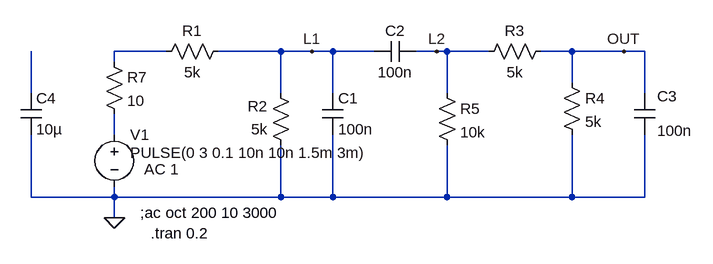
[diagram p0: schematic CW-PHONE-BAND-PASS-LTSpice.asc]
CW-PHONE-BAND-PASS-LTSpice.asc, the LTspice schematic file:
Version 4
SHEET 1 1256 680
WIRE 96 80 16 80
WIRE 272 80 176 80
WIRE 320 80 272 80
WIRE 352 80 320 80
WIRE 416 80 352 80
WIRE 512 80 480 80
WIRE 528 80 512 80
WIRE 592 80 528 80
WIRE 720 80 672 80
WIRE 800 80 720 80
WIRE 832 80 800 80
WIRE 16 96 16 80
WIRE 720 128 720 80
WIRE -112 144 -112 80
WIRE 272 144 272 80
WIRE 352 144 352 80
WIRE 528 144 528 80
WIRE 832 144 832 80
WIRE 16 208 16 176
WIRE -112 304 -112 208
WIRE 16 304 16 288
WIRE 16 304 -112 304
WIRE 272 304 272 224
WIRE 272 304 16 304
WIRE 352 304 352 208
WIRE 352 304 272 304
WIRE 528 304 528 224
WIRE 528 304 352 304
WIRE 720 304 720 208
WIRE 720 304 528 304
WIRE 832 304 832 208
WIRE 832 304 720 304
WIRE 16 336 16 304
FLAG 16 336 0
FLAG 800 80 OUT
FLAG 320 80 L1
FLAG 512 80 L2
SYMBOL voltage 16 192 R0
WINDOW 123 46 69 Left 2
WINDOW 39 0 0 Left 0
WINDOW 3 24 44 Left 2
SYMATTR Value2 AC 1
SYMATTR InstName V1
SYMATTR Value PULSE(0 3 0.1 10n 10n 1.5m 3m)
SYMBOL res 192 64 R90
WINDOW 0 0 56 VBottom 2
WINDOW 3 32 56 VTop 2
SYMATTR InstName R1
SYMATTR Value 5k
SYMBOL res 288 240 R180
WINDOW 0 36 76 Left 2
WINDOW 3 36 40 Left 2
SYMATTR InstName R2
SYMATTR Value 5k
SYMBOL res 576 96 R270
WINDOW 0 32 56 VTop 2
WINDOW 3 0 56 VBottom 2
SYMATTR InstName R3
SYMATTR Value 5k
SYMBOL res 704 112 R0
SYMATTR InstName R4
SYMATTR Value 5k
SYMBOL cap 336 144 R0
SYMATTR InstName C1
SYMATTR Value 100n
SYMBOL cap 480 64 R90
WINDOW 0 0 32 VBottom 2
WINDOW 3 32 32 VTop 2
SYMATTR InstName C2
SYMATTR Value 100n
SYMBOL cap 848 208 R180
WINDOW 0 -34 59 Left 2
WINDOW 3 -57 6 Left 2
SYMATTR InstName C3
SYMATTR Value 100n
SYMBOL res 512 128 R0
SYMATTR InstName R5
SYMATTR Value 10k
SYMBOL cap -128 144 R0
SYMATTR InstName C4
SYMATTR Value 10µ
SYMBOL res 0 80 R0
SYMATTR InstName R7
SYMATTR Value 10
TEXT 56 328 Left 2 !;ac oct 200 10 3000
TEXT 72 360 Left 2 !.tran 0.2

The netlist it stands for:
* CW-PHONE-BAND-PASS-LTSpice.asc
V1 N003 0 PULSE(0 3 0.1 10n 10n 1.5m 3m) AC 1
R1 L1 N001 5k
R2 0 L1 5k
R3 L2 OUT 5k
R4 OUT 0 5k
C1 L1 0 100n
C2 L2 L1 100n
C3 0 OUT 100n
R5 L2 0 10k
C4 N002 0 10µ
R7 N001 N003 10
;ac oct 200 10 3000
.tran 0.2
.backanno
.end